# EAGLE board EEZ DIB DCP405 r2B11 (EAGLE 7.2.0), part 1 of 2
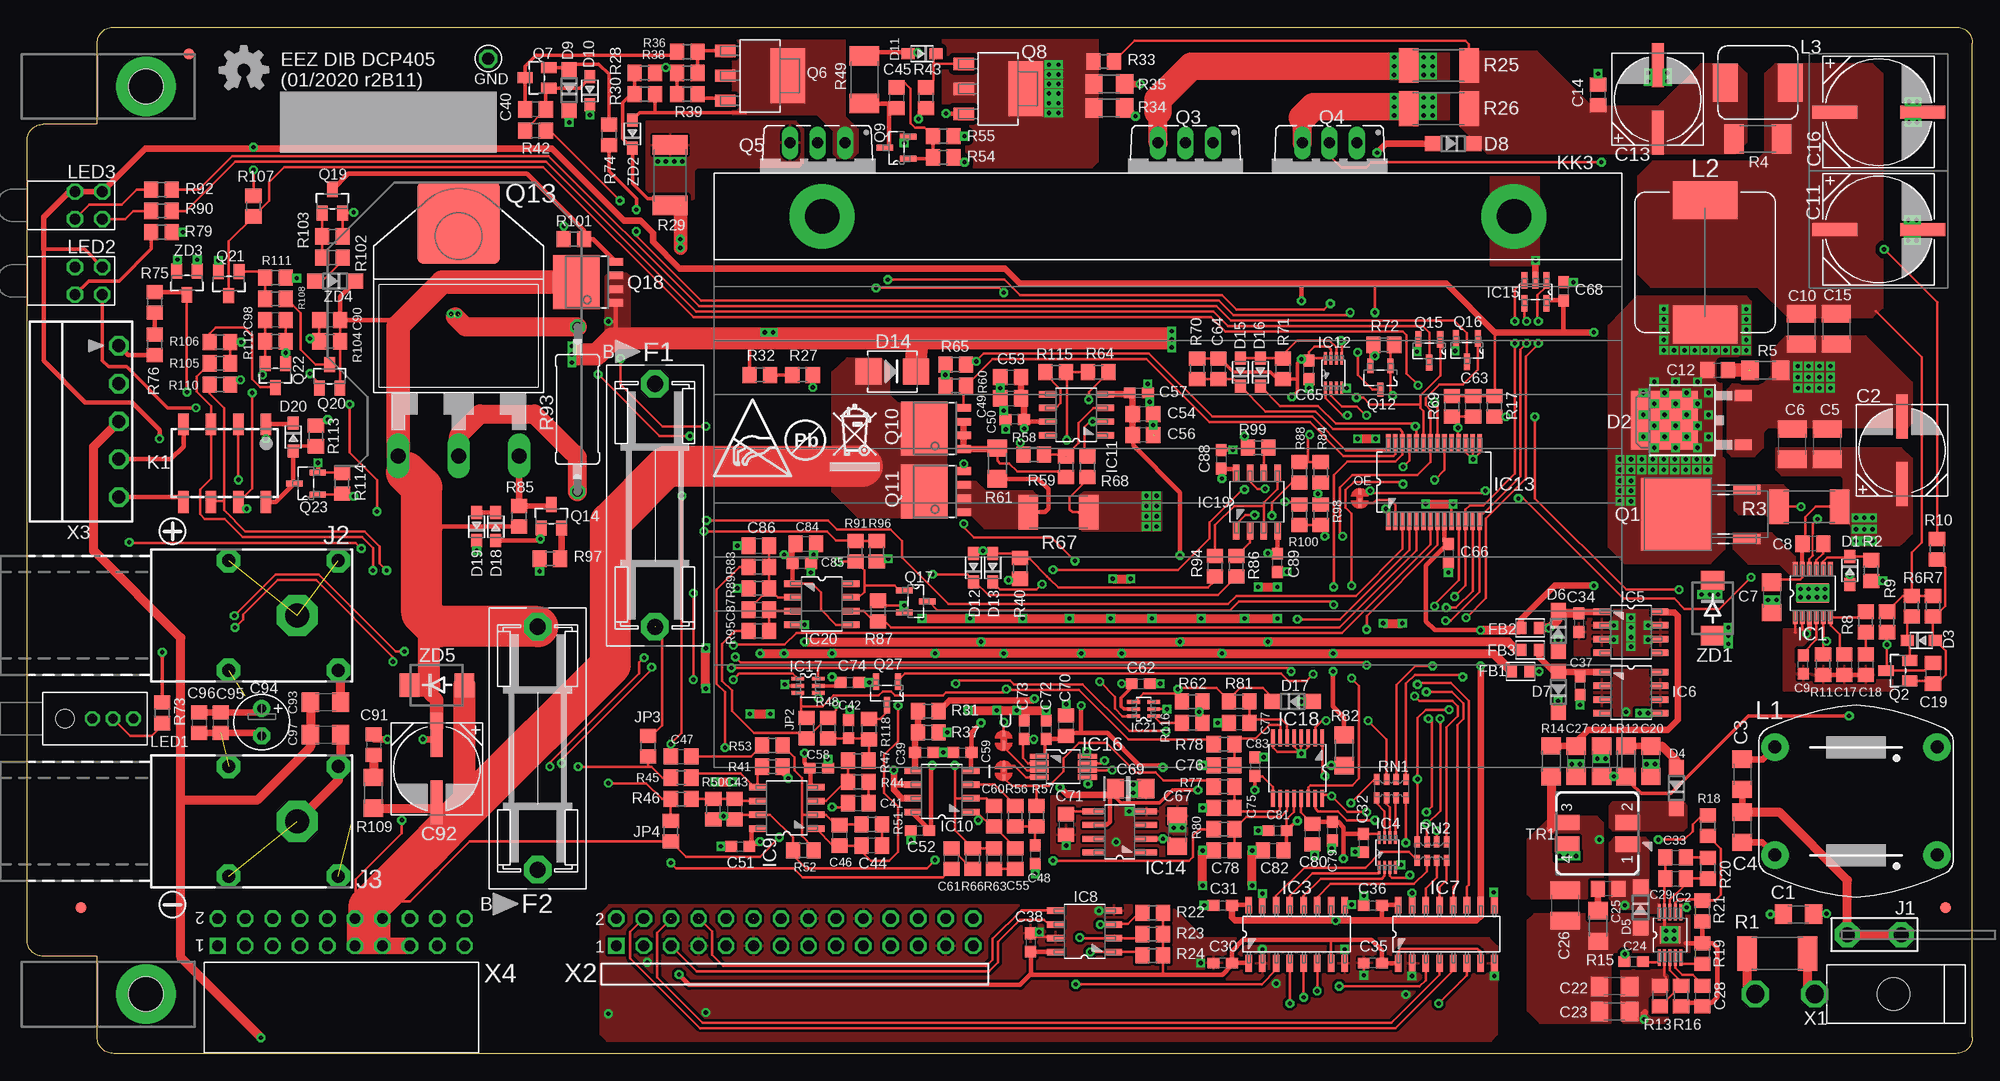
[diagram p6: board, top side]
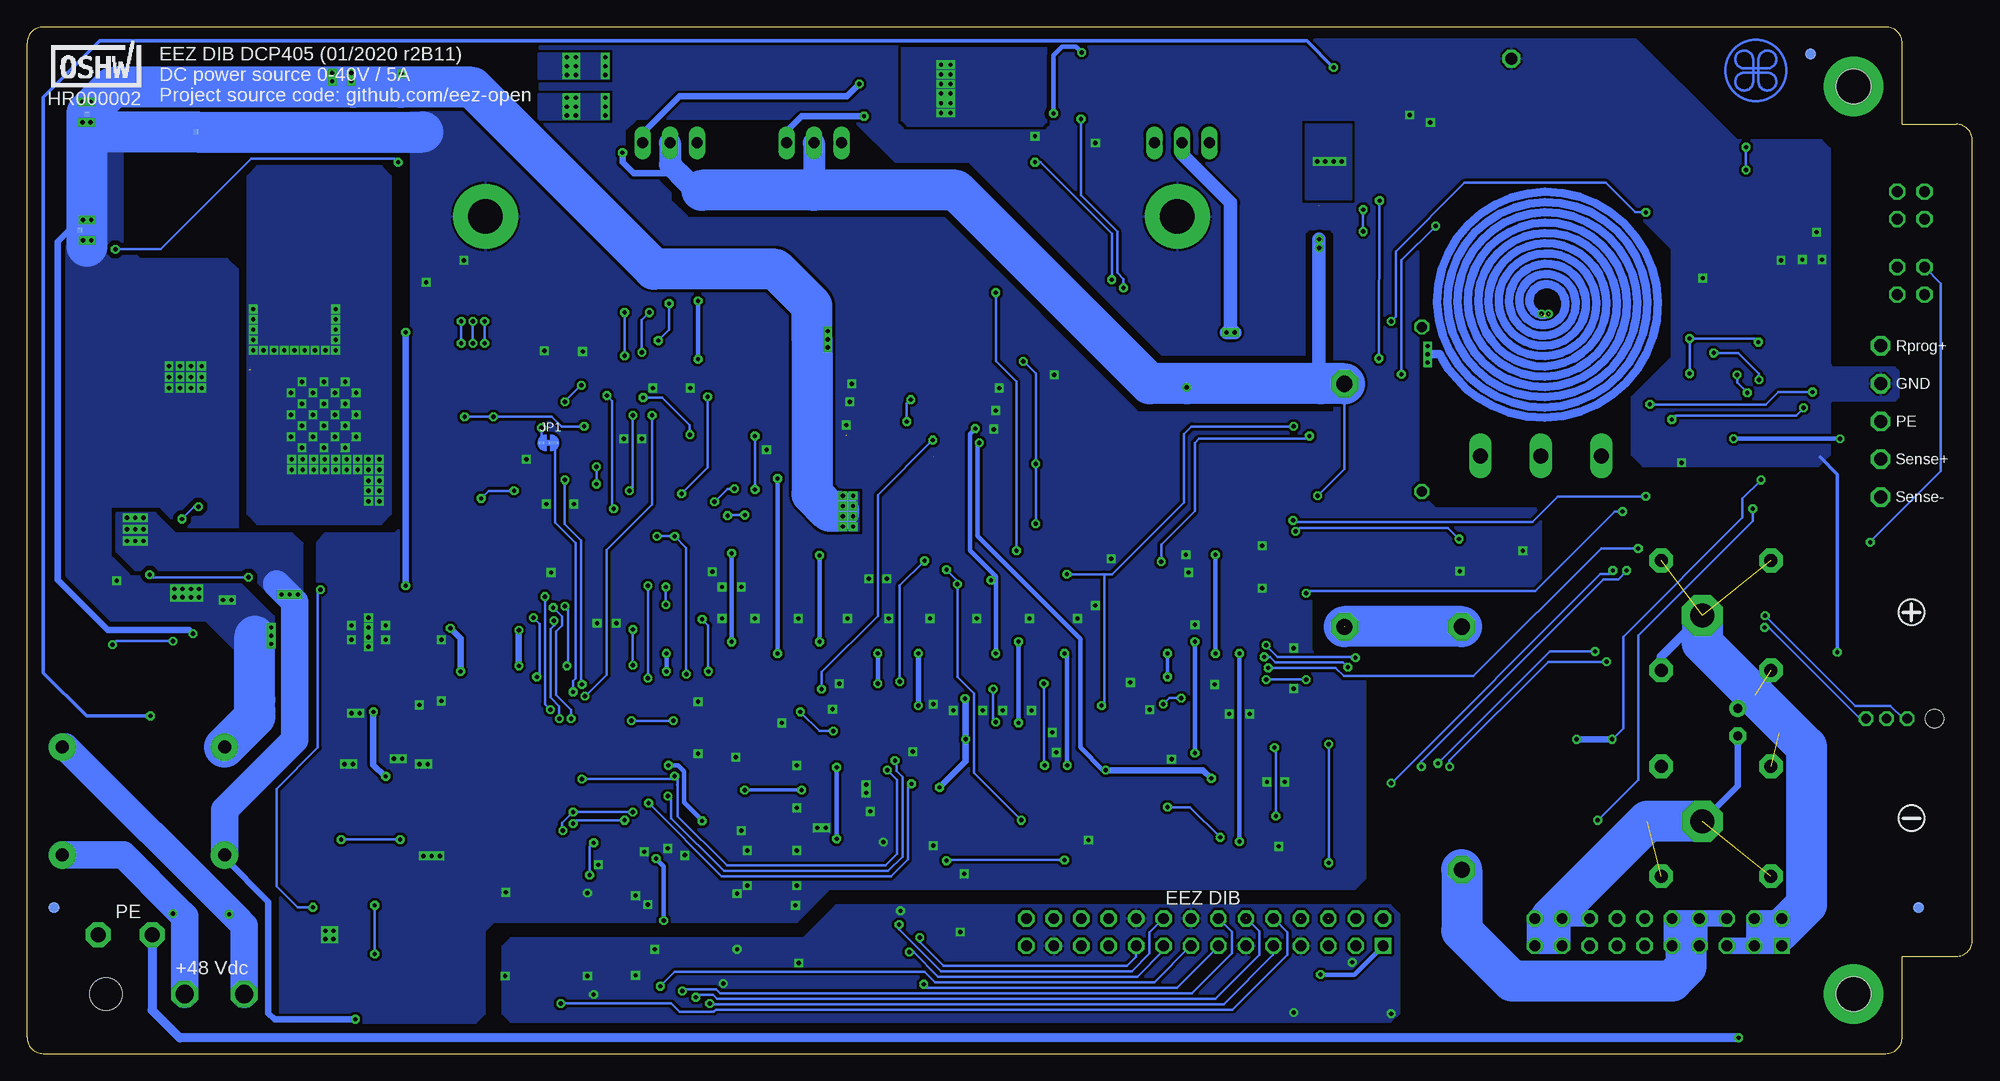
[diagram p7: board, bottom side, seen from below]

Size 180 x 95 mm. Coordinates in mm from the lower left corner, seen from the top.
Outline: 8,95 178.5,95 arc-90 180,93.5 180,1.5 arc-90 178.5,0 8,0 arc-90 6.5,1.5 6.5,9 1.5,9 arc-90 0,10.5 0,84.5 arc-90 1.5,86 6.5,86 6.5,93.5 arc-90 8,95
Copper layers (1*16): Top 0.035mm / dielectric 1.5mm / Bottom 0.035mm
Design rules "default *": minimum track width 6mil, minimum drill 0.3mm, track to track 6mil, track to pad 6mil, pad to pad 6mil, via to via 6mil, smd to smd 6mil, copper to edge 40mil, drill to drill 8mil, minimum pad ring 4mil, minimum via ring 8mil, stop-mask expansion 2.5mil, vias tented up to drill 1mm, thermal gap 8mil
Net classes: 0 default: width 0.203 mm, drill 0.3 mm, clearance 0.203 mm; 1 lvds: width 0.152 mm, drill 0.3 mm, clearance 0.152 mm to class 0, clearance 0.152 mm; 2 gnd: width 0.254 mm, drill 0.584 mm, clearance 0.254 mm
vRestrict: area 53,0 to 128,8.5; area 0,0 to 42,14

## Footprints (pad centres in the part's own frame; a part is rotated, then mirrored left to right if it is on the bottom)
C1206 = smd 1.6 x 1.8: 1 -1.4,0; 2 1.4,0
CAPAE830X1050N = smd 4.064 x 1.092: + -3.124,0; - 3.124,0
C1210 = smd 1.6 x 2.7: 1 -1.4,0; 2 1.4,0
C0805 = smd 1.3 x 1.5: 1 -0.95,0; 2 0.95,0
C0603 = smd 1.1 x 1: 1 -0.85,0; 2 0.85,0
CAPAE1030X1050N = smd 4.166 x 1.194: + -4.064,0; - 4.064,0
EC1206 = smd 1.6 x 1.8: + -1.4,0; - 1.4,0
ECAP2/5 = drill 0.813 pad 1.6: + -1.27,0 | drill 0.813 pad 1.6 octagon: - 1.27,0
SOD323-R = smd 1.2 x 1: A 1.3,0; C -1.3,0
TO252-L = smd 1 x 1.6: 1 -2.28,-6.07; 2 2.28,-6.07 | smd 5.4 x 6.2: 3 0,1.23
SOD123 = smd 1.4 x 1.4: A 1.9,0; C -1.9,0
SMB = smd 2.4 x 2.4: A 2.2,0; C -2.2,0
ZH32 = drill 1.5 pad 2.54 octagon: 1 -11.25,0; 2 11.25,0
BEAD0603 = smd 1 x 1.1: P$1 -0.85,0; P$2 0.85,0
FIDUCIAL_DUAL = smd 1.016 x 1.016 bottom: B 0,0 | smd 1.016 x 1.016: T 0,0
PCB_SHIELD_TAB = drill 1.1 octagon: 1 0,0
JP2-NOCUT = smd 0.889 x 0.254: 1 -0.445,0 | smd 0.508 x 0.254: 2 0.635,0
LTC_05-08-1666 = smd 1.27 x 0.457: 1 -2.235,1.63; 2 -2.235,0.98; 3 -2.235,0.33; 4 -2.235,-0.33; 5 -2.235,-0.98; 6 -2.235,-1.63; 7 2.235,-1.63; 8 2.235,-0.98; 9 2.235,-0.33; 10 2.235,0.33; 11 2.235,0.98; 12 2.235,1.63 | smd 1.753 x 2.946: TP 0,0
SOP50P490X110-11N = smd 1.549 x 0.279: 1 -2.108,0.991; 2 -2.108,0.508; 3 -2.108,0; 4 -2.108,-0.508; 5 -2.108,-0.991; 6 2.108,-0.991; 7 2.108,-0.508; 8 2.108,0; 9 2.108,0.508; 10 2.108,0.991 | smd 1.575 x 1.88: TP 0,0
SOIC-16 = smd 1.549 x 0.61: 1 -2.692,4.445; 2 -2.692,3.175; 3 -2.692,1.905; 4 -2.692,0.635; 5 -2.692,-0.635; 6 -2.692,-1.905; 7 -2.692,-3.175; 8 -2.692,-4.445; 9 2.692,-4.445; 10 2.692,-3.175; 11 2.692,-1.905; 12 2.692,-0.635; 13 2.692,0.635; 14 2.692,1.905; 15 2.692,3.175; 16 2.692,4.445
DCU8 = smd 1.168 x 0.254: 1 -1.372,0.75; 2 -1.372,0.25; 3 -1.372,-0.25; 4 -1.372,-0.75; 5 1.372,-0.75; 6 1.372,-0.25; 7 1.372,0.25; 8 1.372,0.75
SOIC127P600X173-8N = smd 1.55 x 0.6: 1 -2.7,1.9; 2 -2.7,0.63; 3 -2.7,-0.64; 4 -2.7,-1.91; 5 2.7,-1.91; 6 2.7,-0.64; 7 2.7,0.63; 8 2.7,1.9
SOP65P780X200-28N = smd 1.651 x 0.432: 1 -3.632,4.216; 2 -3.632,3.581; 3 -3.632,2.921; 4 -3.632,2.286; 5 -3.632,1.626; 6 -3.632,0.965; 7 -3.632,0.33; 8 -3.632,-0.33; 9 -3.632,-0.965; 10 -3.632,-1.626; 11 -3.632,-2.286; 12 -3.632,-2.921; 13 -3.632,-3.581; 14 -3.632,-4.216; 15 3.632,-4.216; 16 3.632,-3.581; 17 3.632,-2.921; 18 3.632,-2.286; 19 3.632,-1.626; 20 3.632,-0.965; 21 3.632,-0.33; 22 3.632,0.33; 23 3.632,0.965; 24 3.632,1.626; 25 3.632,2.286; 26 3.632,2.921; 27 3.632,3.581; 28 3.632,4.216
SOIC127P600X175-8N = smd 1.981 x 0.559: 1 -2.464,1.905; 2 -2.464,0.635; 3 -2.464,-0.635; 4 -2.464,-1.905; 5 2.464,-1.905; 6 2.464,-0.635; 7 2.464,0.635; 8 2.464,1.905
SOT23-5 = smd 1.524 x 0.559: 1 -1.079,1.016; 2 -1.079,0; 3 -1.079,-1.016; 4 1.079,-1.016; 5 1.079,1.016
DGK8-M = smd 1.727 x 0.483: 1 -2.235,0.965; 2 -2.235,0.33; 3 -2.235,-0.33; 4 -2.235,-0.965; 5 2.235,-0.965; 6 2.235,-0.33; 7 2.235,0.33; 8 2.235,0.965
SOT65P210X110-6N = smd 1.168 x 0.356: 1 -0.94,0.66; 2 -0.94,0; 3 -0.94,-0.66; 4 0.94,-0.66; 5 0.94,0; 6 0.94,0.66
PW(R-PDSO-G16) = smd 1.6 x 0.35: 1 -2.8,2.3; 2 -2.8,1.65; 3 -2.8,1; 4 -2.8,0.35; 5 -2.8,-0.3; 6 -2.8,-0.95; 7 -2.8,-1.6; 8 -2.8,-2.25; 9 2.8,-2.25; 10 2.8,-1.6; 11 2.8,-0.95; 12 2.8,-0.3; 13 2.8,0.35; 14 2.8,1; 15 2.8,1.65; 16 2.8,2.3
PCB_TAB-4907 = drill 1.4 pad 2.3 octagon: 1 -2.5,0; 2 2.5,0
S16N-PC = drill 2.2 pad 3.81 octagon: 1 0,0 | drill 1.2 pad 2.184 octagon: NC1 -3.8,5.08; NC2 -3.8,-5.08; NC3 6.36,5.08; NC4 6.36,-5.08
R_0805 = smd 1.3 x 1.5: 1 -0.95,0; 2 0.95,0
G6K-2F = smd 1 x 2: 1 -3.81,-3.6; 2 -1.27,-3.6; 3 1.27,-3.6; 4 3.81,-3.6; 5 3.81,3.6; 6 1.27,3.6; 7 -1.27,3.6; 8 -3.81,3.6
PCB-MB = hole 3.2: 0,0
SK96/84 = drill 3.2 pad 6: 1 10,4; 2 74,4
RN112 = drill 1.2 pad 2.54: 1 -7.5,5; 2 7.5,5; 3 -7.5,-5; 4 7.5,-5
125CDMCC/DS = smd 3.5 x 6: 1 -5.75,0; 2 5.75,0
COILCRAFT_HPI0630 = smd 2.3 x 3.5: 1 -3,0; 2 3,0
L-42WUM-1EGWT = drill 0.9 octagon: CC 4.445,0; GREEN 6.35,0; RED 2.54,0 | hole 1.7: 0,0
WP934MD = drill 1 octagon: BA -1.27,1.27; BC -1.27,-1.27; TA 1.27,1.27; TC 1.27,-1.27
TO229P990X239-3N = smd 0.94 x 2.489: 1 -2.286,-6.401; 3 2.286,-6.401 | smd 6.731 x 6.528: 2 0,0.152
SOT23-BEC = smd 1 x 1.4: B -0.95,-1.1; C 0,1.1; E 0.95,-1.1
TO220FP-V = drill 1.016 long: 1 -2.54,-0.203; 2 0,-0.203; 3 2.54,-0.203
SOT230P700X180-4N = smd 1.905 x 1.143: 1 -3.2,2.311; 2 -3.2,0; 3 -3.2,-2.311 | smd 3.175 x 5.08: 4 2.565,0
SOT103P240X110-3N = smd 1.524 x 0.559: 1 -1.079,1.016; 2 -1.079,-1.016; 3 1.079,0
SOT669 = smd 0.7 x 1.4: 1 -1.905,-2.65; 2 -0.635,-2.65; 3 0.635,-2.65; 4 1.905,-2.65 | smd 5 x 4.3: MB 0,1
SOT95P237X112-3N = smd 1.321 x 0.559: 1 -1.092,0.94; 2 -1.092,-0.94; 3 1.092,0
TOP3_TRIAC_NOHOLE = drill 1.397 long: A1 -5.588,-20.32; A2 0,-20.32; G 5.588,-20.32 | smd 7.62 x 7.62: NC 0,1.27
R2512 = smd 1.8 x 3.2: 1 -2.8,0; 2 2.8,0
R0805 = smd 1.3 x 1.5: 1 -0.95,0; 2 0.95,0
R2010 = smd 1.8 x 2.7: 1 -2.2,0; 2 2.2,0
R1206 = smd 1.6 x 1.803: 1 -1.422,0; 2 1.422,0
R_2512-4WIRE = smd 1.8 x 3.2: 1 -2.8,0; 2 2.8,0 | smd 1.27 x 0.254: 1S -2.413,0; 2S 2.413,0
0411/15 = drill 0.914 octagon: 1 -7.62,0; 2 7.62,0
CAY16 = smd 0.5 x 1: 1 -1.35,-0.85; 2 -0.45,-0.85; 3 0.45,-0.85; 4 1.35,-0.85; 5 1.35,0.85; 6 0.45,0.85; 7 -0.45,0.85; 8 -1.35,0.85
SHORT_NOHOLE = smd 0.5 x 0.25 bottom: 1 0,0.117; 2 0,-0.117
SRF0703 = smd 1.4 x 2.3: 1 1,2.8; 2 -1,2.8; 3 -1,-2.8; 4 1,-2.8
MINIFIT_39301020 = drill 1.7 octagon: 1 0,0; 2 0,5.5 | hole 3: 0,-7.3
77317-104-28LF = drill 1 pad 1.5 square: 1 -33.02,-2.54 | drill 1 pad 1.5 octagon: 2 -33.02,0; 3 -30.48,-2.54; 4 -30.48,0; 5 -27.94,-2.54; 6 -27.94,0; 7 -25.4,-2.54; 8 -25.4,0; 9 -22.86,-2.54; 10 -22.86,0; 11 -20.32,-2.54; 12 -20.32,0; 13 -17.78,-2.54; 14 -17.78,0; 15 -15.24,-2.54; 16 -15.24,0; 17 -12.7,-2.54; 18 -12.7,0; 19 -10.16,-2.54; 20 -10.16,0; 21 -7.62,-2.54; 22 -7.62,0; 23 -5.08,-2.54; 24 -5.08,0; 25 -2.54,-2.54; 26 -2.54,0; 27 0,-2.54; 28 0,0
MC1,5/5-G-3,5 = drill 1.2 octagon: 1 -7,0; 2 -3.5,0; 3 0,0; 4 3.5,0; 5 7,0
SSW-110-02-T-D-RA = drill 1 pad 1.5 square: 1 22.86,2.54 | drill 1 pad 1.5 octagon: 2 22.86,0; 3 20.32,2.54; 4 20.32,0; 5 17.78,2.54; 6 17.78,0; 7 15.24,2.54; 8 15.24,0; 9 12.7,2.54; 10 12.7,0; 11 10.16,2.54; 12 10.16,0; 13 7.62,2.54; 14 7.62,0; 15 5.08,2.54; 16 5.08,0; 17 2.54,2.54; 18 2.54,0; 19 0,2.54; 20 0,0
DO214AA = smd 1.8 x 2.2: A 2.55,0; C -2.55,0
SOT23 = smd 1 x 1.4: 1 -0.95,-1.1; 2 0.95,-1.1; 3 0,1.1

## Placement (x,y rotation side)
C1  10n/200V  [C1206]  163.89,12.89 0 top
C2  HHXC630A330MHA0G  [CAPAE830X1050N]  173.48,55.82 90 top
C3  10n/200V  [C1206]  158.69,25.84 270 top
C4  10n/200V  [C1206]  158.69,20.95 270 top
C5  4u7/100V  [C1210]  166.56,56.39 90 top
C6  4u7/100V  [C1210]  163.32,56.39 90 top
C7  1u/100V  [C1206]  161.42,42.23 270 top
C8  470n  [C0805]  165.23,47.18 180 top
C9  100n  [C0603]  164.34,36 90 top
C10  10u  [C1210]  164.15,67.06 270 top
C11  EEEFK1J101P  [CAPAE1030X1050N]  171.32,76.26 0 top
C12  470p  [C0805]  156.4,63.25 0 top
C13  EEEFK1H470P  [CAPAE830X1050N]  150.88,88.33 90 top
C14  N.C.  [C0805]  145.35,88.71 90 top
C15  10u  [C1210]  167.39,67.06 270 top
C16  EEEFK1J101P  [CAPAE1030X1050N]  171.32,87.12 0 top
C17  33p  [C0805]  168.15,36 270 top
C18  6n8  [C0805]  170.12,36 270 top
C19  470p  [C0805]  176.34,35.18 270 top
C20  4u7  [C1206]  150.24,27.05 270 top
C21  4u7  [C1206]  145.67,27.05 90 top
C22  2u2  [C1206]  146.88,6.22 180 top
C23  2u2  [C1206]  146.88,3.87 180 top
C24  100n  [C0603]  148.65,8.51 0 top
C25  330p  [C0805]  146.3,15.24 180 top
C26  22u  [C1210]  142.3,13.72 270 top
C27  4u7  [C1206]  143.32,27.05 270 top
C28  10n  [C0805]  155,5.33 270 top
C29  33p  [C0805]  152.53,16.19 0 top
C30  100n  [C0603]  110.62,8.38 180 top
C31  100n  [C0603]  110.62,13.72 0 top
C32  100n  [C0603]  123.63,19.49 270 top
C33  10n  [C0805]  152.53,18.16 0 top
C34  100n  [C0603]  143.57,39.88 270 top
C35  100n  [C0603]  124.52,8.38 180 top
C36  100n  [C0603]  124.52,13.72 0 top
C37  100n  [C0603]  143.7,34.04 90 top
C38  100n  [C0603]  92.84,10.29 270 top
C39  100n  [C0603]  82.99,27.88 0 top
C40  N.C.  [C0805]  47.05,87.38 180 top
C41  100p  [C0805]  76.9,23.18 0 top
C42  100n  [C0603]  76.01,30.04 90 top
C43  N.C.  [C0805]  65.47,22.61 270 top
C44  N.C.  [C0805]  78.17,19.24 180 top
C45  N.C.  [C0805]  80.45,88.46 270 top
C46  33p  [C0805]  75.18,20.19 270 top
C47  100p  [C0805]  60.52,27.5 0 top
C48  100n  [C0603]  93.28,18.41 270 top
C49  10n  [C0805]  91,60.64 0 top
C50  100n  [C0603]  91.38,58.67 180 top
C51  100n  [C0603]  65.98,19.18 0 top
C52  100n  [C0603]  82.61,20.64 0 top
C53  1u  [C0805]  91,62.61 0 top
C54  10n  [C0805]  103.25,59.18 180 top
C55  4n7  [C0805]  91.44,18.03 90 top
C56  1u  [C0805]  103.25,57.23 180 top
C57  100n  [C0603]  102.87,61.15 0 top
C58  100n  [C0603]  73.28,26.42 180 top
C59  100n  [C0603]  86.55,27.88 0 top
C60  33p  [C0805]  89.47,21.97 270 top
C61  6n8  [C0805]  85.53,18.03 90 top
C62  100n  [C0603]  103.06,34.23 0 top
C63  330p  [C0805]  133.79,59.88 90 top
C64  4n7  [C0805]  110.24,63.37 90 top
C65  100n  [C0603]  118.59,63.28 90 top
C66  100n  [C0603]  131.51,46.29 270 top
C67  4u7  [C1206]  106.43,20.57 90 top
C68  100n  [C0603]  142.18,70.55 90 top
C69  4u7 tant.  [EC1206]  102.11,24.51 0 top
C70  1u  [C0805]  96.14,30.35 90 top
C71  1u  [C0805]  96.14,21.21 270 top
C72  100n  [C0603]  94.3,29.97 270 top
C73  100n  [C0603]  92.27,29.97 270 top
C74  100n  [C0603]  76.14,34.35 0 top
C75  4n7  [C0805]  110.74,22.73 0 top
C76  4n7  [C0805]  110.74,26.67 0 top
C77  4n7  [C0805]  112.14,30.61 180 top
C78  4n7  [C0805]  110.74,18.8 0 top
C79  100n  [C0603]  120.78,20.57 90 top
C80  1u  [C0805]  118.94,20.32 90 top
C81  100n  [C0603]  115.7,20.64 0 top
C82  1u  [C0805]  115.32,18.8 0 top
C83  100n  [C0603]  113.6,26.54 270 top
C84  N.C.  [C0805]  72.07,47.18 0 top
C85  100n  [C0603]  71.69,45.34 180 top
C86  N.C.  [C0805]  67.69,46.99 0 top
C87  4n7  [C0805]  67.69,41.08 0 top
C88  100n  [C0603]  110.49,54.99 270 top
C89  100n  [C0603]  115.7,45.4 90 top
C90  10n  [C0805]  28,67.88 180 top
C91  470n  [C0805]  32.07,28.57 270 top
C92  HHXC630A330MHA0G  [CAPAE830X1050N]  37.91,26.35 270 top
C93  10n/200V  [C1206]  27.62,32.51 180 top
C94  N.C.  [ECAP2/5]  21.72,30.67 270 top
C95  N.C.  [C0805]  17.91,30.61 270 top
C96  N.C.  [C0805]  15.94,30.61 270 top
C97  10n/200V  [C1206]  27.62,29.53 0 top
C98  10n  [C0805]  22.99,67.88 180 top
D1  BAS316  [SOD323-R]  168.66,44.7 270 top
D2  STPS15H100  [TO252-L]  152.72,58.61 90 top
D3  BAS316  [SOD323-R]  175.26,38.23 0 top
D4  SKL16  [SOD123]  152.59,24.57 90 top
D5  SKL16  [SOD123]  149.29,13.53 270 top
D6  SKL14  [SOD123]  141.67,39.12 270 top
D7  SKL14  [SOD123]  141.67,33.46 90 top
D8  N.C.  [SOD123]  131.95,84.2 180 top
D9  SKL14  [SOD123]  50.16,89.15 90 top
D10  BAS316  [SOD323-R]  52.07,89.09 90 top
D11  BAS316  [SOD323-R]  82.8,92.52 180 top
D12  BAS316  [SOD323-R]  87.57,44.96 90 top
D13  BAS316  [SOD323-R]  89.34,44.96 90 top
D14  SK55  [SMB]  80.07,63.12 180 top
D15  BAS316  [SOD323-R]  112.27,63.06 90 top
D16  BAS316  [SOD323-R]  114.11,63.06 90 top
D17  SKL14  [SOD123]  117.09,32.58 0 top
D18  BAS316  [SOD323-R]  43.37,48.77 270 top
D19  BAS316  [SOD323-R]  41.59,48.77 90 top
D20  BAS316  [SOD323-R]  24.64,57.05 270 top
EEZ_SIGNATURE  SIGNATURESMALL  [SIGNATURE_5MM]  20.05,90.97 180 top
F1  ZH32  [ZH32]  58.1,50.74 270 top
F2  ZH32  [ZH32]  47.24,28.26 270 top
FB1  1K@100MHz  [BEAD0603]  138.18,35.37 180 top
FB2  1K@100MHz  [BEAD0603]  139.06,39.37 180 top
FB3  1K@100MHz  [BEAD0603]  139.06,37.34 180 top
FM1  FIDUCIAL_2  [FIDUCIAL_DUAL]  15,92.5 0 top
FM2  FIDUCIAL_2  [FIDUCIAL_DUAL]  177.5,13.5 0 top
FM3  FIDUCIAL_2  [FIDUCIAL_DUAL]  5,13.5 0 top
GND  [PCB_SHIELD_TAB]  42.67,92.08 0 top
I_SET  JP2-NOCUT  [JP2-NOCUT]  90.36,26.16 270 top
IC1  LTC3864EMSE#PBF  [LTC_05-08-1666]  165.23,42.61 90 top
IC2  TPS54060DGQ  [SOP50P490X110-11N]  152.02,10.99 90 top
IC3  SI8641BB-B-IS1  [SOIC-16]  117.47,11.05 90 top
IC4  SN74LVC1G139DCUR  [DCU8]  125.86,18.61 90 top
IC5  MC78L05  [SOIC127P600X173-8N]  148.4,38.99 0 top
IC6  MC79L05  [SOIC127P600X173-8N]  148.4,33.4 0 top
IC7  SI8641BB-B-IS1  [SOIC-16]  131.32,11.05 90 top
IC8  M24C32-WMN6P  [SOIC127P600X173-8N]  97.85,11.3 180 top
IC9  TL072D  [SOIC127P600X173-8N]  70.29,22.73 180 top
IC10  TL072D  [SOIC127P600X173-8N]  84.65,24.26 180 top
IC11  LTC2050HVCS8#PBF  [SOIC127P600X173-8N]  97.09,59.12 180 top
IC12  74AUP1G74DC.125  [DCU8]  120.89,62.98 90 top
IC13  MCP23S17-E/SS  [SOP65P780X200-28N]  130.18,52.9 90 top
IC14  REF5025AIDR  [SOIC127P600X175-8N]  101.09,20.51 180 top
IC15  TC77-5.0MCTTR  [SOT23-5]  139.57,70.48 270 top
IC16  DAC8552IDGKR  [DGK8-M]  95.89,26.54 0 top
IC17  SN74LVC1G3157DCKR  [SOT65P210X110-6N]  72.26,34.04 0 top
IC18  ADS1120IPWR  [PW(R-PDSO-G16)]  117.54,26.42 270 top
IC19  LM293D  [SOIC127P600X173-8N]  113.79,51.05 90 top
IC20  MAX9141ESA  [SOIC127P600X173-8N]  73.53,41.59 0 top
IC21  SN74LVC1G3157DCKR  [SOT65P210X110-6N]  103.31,31.88 180 top
J1  4907  [PCB_TAB-4907]  170.92,11 180 top
J2  FCR7350R  [S16N-PC]  25,40.55 180 top
J3  FCR7350B  [S16N-PC]  25,21.5 180 top
JP1  JP2-NOCUT  [JP2-NOCUT]  131.76,56.52 180 bottom
JP2  JP2-CUT-0805  [R_0805]  72.14,30.1 270 top
JP3  JP2-CUT-0805  [R_0805]  57.47,28.45 90 top
JP4  JP2-CUT-0805  [R_0805]  59.56,20.57 90 top
K1  G6K-2F-5DC  [G6K-2F]  18.29,54.64 180 top
KK1  PMB-1  [PCB-MB]  11,89.5 0 top
KK2  PMB-1  [PCB-MB]  11,5.5 0 top
KK3  SK96/84  [SK96/84]  147.57,81.47 180 top
L1  RN112-4-02-0M7  [RN112]  169.23,23.37 180 top
L2  125CDMCCDS-330MC  [125CDMCC/DS]  155.26,73.22 90 top
L3  VLS6045AF-3R3N  [COILCRAFT_HPI0630]  160.15,89.85 180 top
LED1  WP42WUM/EGW  [L-42WUM-1EGWT]  3.5,31 0 top
LED2  WP934MD/2LID  [WP934MD]  5.7,71.5 0 top
LED3  WP934MD/LYLID  [WP934MD]  5.7,78.5 0 top
OE  JP2-NOCUT  [JP2-NOCUT]  123.32,51.37 90 top
OSHWA  HR000002  [CERT-SMALL-SILK]  173.61,89.41 0 bottom
Q1  SUD19P06-60  [TO229P990X239-3N]  152.72,49.91 90 top
Q2  MMBT5401  [SOT23-BEC]  173.1,35.43 90 top
Q3  D45H11FP  [TO220FP-V]  107.19,84.07 180 top
Q4  D45H11FP  [TO220FP-V]  120.52,84.07 180 top
Q5  FQPF11P06 or FQPF27P06  [TO220FP-V]  73.15,84.07 180 top
Q6  BCP56-16.115  [SOT230P700X180-4N]  67.82,90.49 0 top
Q7  MMBT5401  [SOT23-BEC]  47.18,90.3 90 top
Q8  NZT605  [SOT230P700X180-4N]  89.85,89.28 0 top
Q9  BSS205NH6327XTSA1  [SOT103P240X110-3N]  80.45,83.82 180 top
Q10  PSMN0R9-25YLC  [SOT669]  84.01,57.85 90 top
Q11  PSMN0R9-25YLC  [SOT669]  84.01,52.01 90 top
Q12  BSS84P  [SOT95P237X112-3N]  125.22,62.55 270 top
Q13  BTA26-600  [TOP3_TRIAC_NOHOLE]  39.94,75.63 0 top
Q14  FMMT493TA  [SOT23-BEC]  48.51,49.72 0 top
Q15  2N7002  [SOT103P240X110-3N]  129.73,65.02 270 top
Q16  2N7002  [SOT103P240X110-3N]  133.22,65.09 270 top
Q17  2N7002  [SOT103P240X110-3N]  82.23,41.85 0 top
Q18  PSMN013-60YL  [SOT669]  51.82,71.37 90 top
Q19  MMBT5551  [SOT23-BEC]  28.26,78.87 0 top
Q20  MMBT5401  [SOT23-BEC]  28,62.67 0 top
Q21  MMBT5551  [SOT23-BEC]  18.67,71.25 180 top
Q22  MMBT5551  [SOT23-BEC]  22.99,62.74 180 top
Q23  2N7002  [SOT103P240X110-3N]  25.81,52.77 180 top
Q27  2N7002  [SOT103P240X110-3N]  79.57,33.34 270 top
R1  N.C.  [R2512]  161.93,9.27 0 top
R2  10K  [R0805]  170.62,44.7 90 top
R3  R008/2-3W  [R2512]  164.91,50.61 180 top
R4  15R  [R2010]  160.15,84.65 180 top
R5  10R  [R1206]  160.85,63.25 180 top
R6  10K  [R0805]  174.37,41.4 270 top
R7  100K  [R0805]  176.34,41.4 270 top
R8  1K  [R0805]  170.12,39.94 90 top
R9  330K  [R0805]  172.09,39.94 270 top
R10  100K  [R0805]  176.72,46.67 90 top
R11  4K7  [R0805]  166.18,36 270 top
R12  10R  [R1206]  147.96,27.05 90 top
R13  47K  [R0805]  151.07,5.33 90 top
R14  10R  [R1206]  141.03,27.05 270 top
R15  10R  [R1206]  145.35,11.81 90 top
R16  2K2  [R0805]  153.03,5.33 90 top
R17  10K  [R0805]  135.76,59.88 270 top
R18  100K  [R0805]  155.51,21.08 90 top
R19  330K  [R0805]  155,9.27 270 top
R20  86K6  [R0805]  155.51,17.14 270 top
R21  10K  [R0805]  155,13.21 90 top
R22  10K  [R0805]  104.14,13.02 180 top
R23  10K  [R0805]  104.14,11.05 180 top
R24  10K  [R0805]  104.14,9.08 180 top
R25  0R1/2-3W  [R2512]  130.62,91.44 180 top
R26  0R1/2-3W  [R2512]  130.62,87.44 180 top
R27  4K7  [R0805]  71.75,62.8 0 top
R28  N.C.  [R0805]  57.15,90.74 180 top
R29  2R2/2W  [R2512]  59.5,81.28 270 top
R30  4K7  [R0805]  57.15,88.77 0 top
R31  10K  [R0805]  83.38,31.69 180 top
R32  4K7  [R0805]  67.82,62.8 0 top
R33  2K2  [R0805]  99.63,91.82 0 top
R34  10R  [R1206]  100.14,87.5 0 top
R35  10R  [R1206]  100.14,89.73 0 top
R36  4K7  [R0805]  61.09,92.71 180 top
R37  220R  [R0805]  83.38,29.72 0 top
R38  1K  [R0805]  61.09,90.74 180 top
R39  220R  [R0805]  61.09,88.77 180 top
R40  2K2  [R0805]  91.88,44.89 270 top
R41  7K5 0.1%  [R0805]  68.96,26.54 180 top
R42  22K  [R0805]  47.05,85.41 180 top
R43  1K  [R0805]  83.19,88.46 90 top
R44  10K  [R0805]  76.9,25.15 180 top
R45  124K 0.1%  [R0805]  60.52,25.53 180 top
R46  124K 0.1%  [R0805]  60.52,23.56 180 top
R47  10K  [R0805]  76.9,27.11 180 top
R48  2K2  [R0805]  74.1,30.1 270 top
R49  15R  [R2010]  77.47,90.11 90 top
R50  7K5 0.1%  [R0805]  63.5,22.61 90 top
R51  N.C.  [R0805]  78.17,21.21 0 top
R52  10K  [R0805]  71.82,18.8 0 top
R53  10K  [R0805]  68.96,28.51 0 top
R54  220R  [R0805]  84.77,82.93 0 top
R55  100K  [R0805]  84.77,84.9 180 top
R56  2K2  [R0805]  91.44,21.97 90 top
R57  2K2  [R0805]  93.41,21.97 270 top
R58  39K 0.1%  [R0805]  93.15,55.44 0 top
R59  820R 0.1%  [R0805]  96.14,54.29 90 top
R60  47K  [R0805]  85.92,61.79 0 top
R61  1R  [R1206]  89.79,54.61 270 top
R62  47K  [R0805]  107.82,32.58 0 top
R63  8K2  [R0805]  89.47,18.03 90 top
R64  39K 0.1%  [R0805]  99.12,63.06 180 top
R65  47K  [R0805]  85.92,63.75 0 top
R66  3K3  [R0805]  87.5,18.03 90 top
R67  0R010 (low TCR)  [R_2512-4WIRE]  95.44,50.1 180 top
R68  820R 0.1%  [R0805]  98.11,54.29 90 top
R69  1K  [R0805]  131.83,59.88 270 top
R70  4K7  [R0805]  108.27,63.37 270 top
R71  10K  [R0805]  116.2,63.37 90 top
R72  100K  [R0805]  125.54,65.6 0 top
R73  270R  [R0805]  12.51,31.53 90 top
R74  2K2  [R0805]  53.85,85.03 270 top
R75  470R  [R0805]  11.81,69.53 270 top
R76  470R  [R0805]  11.81,65.6 270 top
R77  2K2  [R0805]  110.74,24.7 0 top
R78  2K2  [R0805]  110.74,28.64 0 top
R79  470R  [R0805]  12.45,76.01 180 top
R80  2K2  [R0805]  110.74,20.76 0 top
R81  2K2  [R0805]  112.14,32.58 0 top
R82  10R  [R1206]  121.86,28.07 270 top
R83  330R  [R0805]  67.69,45.02 0 top
R84  4K7  [R0805]  119.7,53.78 270 top
R85  470R  [R0805]  45.53,49.72 270 top
R86  10K  [R0805]  111.89,45.09 90 top
R87  10K  [R0805]  78.74,40.96 270 top
R88  4K7  [R0805]  117.73,53.78 90 top
R89  10K  [R0805]  67.69,43.05 180 top
R90  330R  [R0805]  12.45,77.98 0 top
R91  1K  [R0805]  76.64,46.48 270 top
R92  330R  [R0805]  12.45,79.95 180 top
R93  AC01000001007JA100  [0411/15]  50.93,59.63 270 top
R94  10K  [R0805]  109.92,45.09 270 top
R95  10K  [R0805]  67.69,39.12 0 top
R96  100K  [R0805]  78.61,46.48 90 top
R97  6R2  [R0805]  48.39,45.78 0 top
R98  4K7  [R0805]  119.7,49.85 90 top
R99  10K  [R0805]  113.92,56.07 0 top
R100  4K7  [R0805]  117.73,49.85 270 top
R101  1K  [R0805]  50.61,75.37 180 top
R102  22K  [R0805]  28.26,73.66 0 top
R103  22K  [R0805]  28.26,75.63 180 top
R104  330R  [R0805]  28,65.91 0 top
R105  750R  [R0805]  17.84,63.88 0 top
R106  3K3  [R0805]  17.84,65.85 0 top
R107  10K  [R0805]  20.95,78.42 90 top
R108  10K  [R0805]  22.99,69.85 0 top
R109  1R  [R1206]  32.07,24.13 90 top
R110  750R  [R0805]  17.84,61.91 180 top
R111  47K  [R0805]  22.99,71.82 180 top
R112  330R  [R0805]  22.99,65.91 0 top
R113  470R  [R0805]  26.73,57.15 90 top
R114  100K  [R0805]  29.15,52.77 270 top
R115  220R  [R0805]  95.19,63.06 180 top
R116  470R  [R0805]  107.82,30.61 0 top
R118  22K  [R0805]  77.91,30.04 270 top
RN1  DR1206-33R-4/8  [CAY16]  126.24,24.51 0 top
RN2  DR1206-33R-4/8  [CAY16]  129.98,18.73 0 top
SH1  [SHORT_NOHOLE]  164.4,85.28 270 top
SH2  Pgnd to Pout- short  [SHORT_NOHOLE]  174.43,86.93 0 top
SH3  Sgnd to Pgnd short  [SHORT_NOHOLE]  175.13,76.2 270 top
TR1  SRF0703-821M  [SRF0703]  145.29,20.38 270 top
U$1  [RECYCLE_BIN1/8]  74.3,53.91 0 top
U$6  [ESD_SYMBOL]  63.59,53.43 0 top
U$7  [PB_SMALL]  72.01,56.77 0 top
U_SET  JP2-NOCUT  [JP2-NOCUT]  90.36,28.96 90 top
X1  39-30-1020  [MINIFIT_39301020]  165.41,5.5 90 top
X2  77317-104-20LF  [77317-104-28LF]  87.54,12.5 0 top
X3  691322110005  [MC1,5/5-G-3,5]  8.5,58.5 270 top
X4  DS1024-2*10R0  [SSW-110-02-T-D-RA]  40.5,12.5 180 top
ZD1  SMAJ51A  [DO214AA]  155.96,41.21 270 top
ZD2  MM3Z9V1T1G  [SOD323-R]  56.01,85.09 90 top
ZD3  SLVU2.8-TP  [SOT23]  14.8,71.31 180 top
ZD4  MMSZ5230BT1G  [SOD123]  28.51,71.5 180 top
ZD5  SMAJ51A  [DO214AA]  37.91,34.1 0 top

## Tracks (layer width: path | path; a pad name or v marks a point on that pad's centre or on a via)
5A_S
  pour Top (isolate 0.254, no thermals): 85.98,52.9 87.82,52.9 88.71,52.01 93.03,52.01 93.41,51.63 93.41,48.64 88.58,48.64 87.38,49.85 85.98,49.85
50MA_S
  Top 0.254: R61.1 89.79,54.86 90.04,54.61 90.87,54.61 91.63,53.85 95.89,53.85 96.14,53.59 R59.1
  Top 0.61: Q10.3 Q10.2 Q10.1 89.24,55.94 R61.1
!ADC_DRDY  (via drill 0.4)
  Top 0.254: IC18.14 118.54,24.62 118.75,24.83 122.62,24.83 123.25,25.46 123.25,34.04 v122.56,34.73 | v127.32,52.7 127.13,52.9 122.75,52.9 121.98,52.13 121.98,50.55 122.56,49.97 v122.56,43.31 | IC13.25 127.89,54.86 v127.32,54.29
  Bottom 0.254: v127.32,54.29 v127.32,52.7 | v122.56,43.31 v122.56,34.73
!DP_DRIVE
  Top 0.305: 50.42,91.31 D9.A | Q7.E 49.97,91.25 D9.A | D9.A 50.16,91.31 50.42,91.57 52.9,91.57 53.85,90.61 R74.1
!IOEXP_RST  (via drill 0.4)
  Top 0.254: IC13.18 132.4,56.59 v132.4,57.91 132.4,58.36 R69.2 C63.1
  Bottom 0.254: JP1.2 v132.4,57.91
!OVP_FAULT  (via drill 0.4)
  Top 0.254: Q17.3 83.44,41.85 84.26,41.02 111.32,41.02 112.14,41.85 120.59,41.85 v120.9,41.53 | v120.9,43.18 120.9,53.53 122.17,54.8 126.62,54.8 127.25,55.44 IC13.26 127.25,57.53 127,57.78 120.84,57.78 119.19,59.44 114.59,59.44 D15.C 111.6,62.42 C64.1 R70.2
  Bottom 0.254: v120.9,41.53 v120.9,43.18
!RESET  (via drill 0.4)
  Top 0.254: IC7.12 131.95,15.43 132.33,15.81 132.33,30.42 132.91,30.99 132.91,32.38 131.83,33.47 v129.48,33.47
  Bottom 0.254: v129.48,33.47 129.48,34.48 129.22,34.73 129.22,47.24 131.13,49.15 131.13,56.33 JP1.1
!SET_DP  (via drill 0.4)
  Top 0.254: IC13.1 125.96,50.19 v125.73,50.42 | R72.2 126.16,65.52 Q12.1 126.16,61.1 v126.36,60.9
  Bottom 0.254: v125.73,50.42 125.86,50.55 125.86,60.39 v126.36,60.9
+3V3  (via drill 0.4)
  Top 0.254: IC7.7 134.49,9.4 134.18,9.72 127.13,9.72 126.87,9.46 IC7.1 | R22.1 R23.1 R24.1 105.09,7.3 | IC3.7 120.65,10.41 120.78,10.54
  Top 0.406: IC7.1 125.33,8.36 C35.1 125.37,9.56 124.4,10.54 120.78,10.54 112.52,10.54 111.47,9.49 C30.1 | 92.88,9.68 C38.2 92.87,9.4 | C30.1 111.51,8.22 111.51,8.19 110.62,7.3 105.09,7.3 92.9,7.3 92.87,7.33 | IC3.1 113,8.38 C30.1 | 92.87,9.4 92.87,7.33 | IC8.8 92.87,9.4 | 92.87,7.33 91.89,6.35 61.28,6.35 v60.33,7.3
  Bottom 0.406: v60.33,7.3 57.18,7.3 X2.1
+5V  (via drill 0.4)
  Top 0.254: IC3.10 120.65,12.38 v121.09,12.32 | IC18.13 117.89,22.32 C80.2 | 138.3,66.67 138.24,66.74 | Q12.2 124.28,65.54 R72.1 124.59,64.7 v124.71,64.58 | R84.2 119.44,52.58 v119.44,51.82 119.44,50.54 R98.2 | 123.74,20.32 125.11,20.32 IC4.8 | v124.71,68.58 124.71,71.25 | R69.1 C63.2 R17.1 135.83,60.89 135.83,66.74 | R70.1 C64.2 | R107.2 v20.96,81.79 | 118.62,64.16 118.62,64.9 119.13,65.41 120.4,65.41 120.64,65.16 IC12.7 | 118.81,64.35 IC12.8
  Top 0.305: IC15.5 140.59,69.72 | 118.81,64.35 C65.2 118.3,64.13 | 1.52,74.42 5.32,74.42 LED2.TA | 117.54,62.42 117.54,63.88 v117.92,64.26 | 117.54,62.42 117.54,61.28 v117.03,60.77 | 117.54,62.42 R71.1 115.69,62.42 115.06,63.06 111.63,63.06 110.62,64.07 110.55,64.07 110.3,64.32 C64.2
  Top 0.406: D20.C 24.52,58.24 K1.1 v22.1,56.9 | v12.26,56.9 12.26,57.72 9.72,60.26 5.4,60.26 1.52,64.14 1.52,74.42 | IC7.16 125.4,13.74 C36.2 125.37,12.41 125.28,12.32 | IC3.16 111.49,13.74 C31.2 | C80.2 119.09,21.42 C79.2 121.32,21.42 121.79,20.95 121.79,20.32 | v121.79,18.03 121.79,20.32 | C32.1 123.74,20.32 121.79,20.32 | C66.1 131.47,47.01 131.28,47.01 129.41,45.15 129.41,40.01 130.24,39.18 v134.49,39.18 | IC13.9 131.14,47.38 C66.1 | 142.15,69.72 142.15,66.89 142.3,66.74 | 140.59,69.72 142.15,69.72 | 142.15,69.72 C68.1 | v117.92,69.66 117.92,71.25 | v117.92,64.26 118.62,64.16 C65.2 | C66.1 131.41,47.14
  Top 0.508: 1.52,74.42 1.52,77.41 3.89,79.77 LED3.BA LED3.TA
  Top 0.61: C31.2 111.47,12.61 111.76,12.32 v121.09,12.32 125.28,12.32 134.11,12.32 134.49,12.7 IC7.10 v134.49,35.88 | FB2.P$2 138.22,40.17 141.35,43.31 v144.97,43.31 | LED3.TA 10.96,83.76 20.83,83.76 v20.95,83.88 v20.96,83.88 21.08,83.76 48.58,83.76 55.24,77.09 56.77,77.09 57.91,75.95 57.91,75.12 60.39,72.64 90.49,72.64 91.89,71.25 117.92,71.25 124.71,71.25 131.32,71.25 135.83,66.74 138.24,66.74 142.3,66.74 v144.97,66.74
  Top 0.813: v134.49,39.18 138.02,39.18 FB2.P$2
  Bottom 0.254: v124.71,64.58 v124.71,68.58 | v117.03,60.77 117.03,54.23 v119.44,51.82 | v20.96,81.79 v20.96,83.88
  Bottom 0.406: v22.1,56.9 v12.26,56.9 | v121.09,12.32 121.09,17.34 v121.79,18.03 | v117.92,64.26 v117.92,69.66
  Bottom 0.61: v144.97,66.74 v144.97,43.31 | v134.49,35.88 v134.49,39.18
+5VOUT  (via drill 0.4)
  Top 0.61: IC5.1 143.73,40.89 C34.1 | FB1.P$1 v139.89,35.37
  Top 0.813: FB2.P$1 139.89,39.4 v140.84,39.37 141.67,40.2 D6.C 141.77,40.73 C34.1
  Bottom 0.61: v139.89,35.37 139.89,38.42 v140.84,39.37
+VNR
  Top 0.61: IC5.8 151.16,40.83 152.4,40.83 152.72,40.51 152.72,30.86 151.83,29.97 144.46,29.97 143.32,28.83 C27.1 | C27.1 143.7,28.45 143.89,28.64 | R14.1 143.3,28.47 C27.1
+VREF  (via drill 0.4)
  Top 0.254: IC18.9 115.25,23.65 115.25,24.7 114.33,25.63 113.67,25.63 C83.2 113.51,26.1 | 92.2,29.06 C73.2 92.14,29 92.14,27.37 92.63,26.87 IC16.2 | 100.14,24.7 100.14,24.26 100.2,24.19
  Top 0.305: 100.14,24.7 100.39,24.45 100.39,24.19 100.39,24 | 100.39,24 101.22,23.18 104.78,23.18 105.98,24.38 v108.33,24.38 | v113.6,24.38 C83.2 | 100.39,24 100.33,24 100.14,23.81 | v93.15,29.08 92.37,29.08 C73.2
  Top 0.406: 100.39,24.19 C69.+ 100.2,24.45 100.2,24.19 100.2,21.46 99.89,21.14 IC14.6
  Top 0.61: v95.57,24.64 96.27,23.94 100.14,23.94 C69.+ | v93.22,32.83 93.09,32.7 85.34,32.7 R31.1
  Bottom 0.254: 93.15,32.77 v93.22,32.83
  Bottom 0.305: v108.33,24.38 v113.6,24.38
  Bottom 0.61: 93.15,32.77 v93.15,29.08 93.15,27.05 v95.57,24.64
-9V  (via drill 0.4)
  Top 0.305: v168.59,31.24 159.26,31.24 152.08,24.07 149.35,24.07 148.4,25.02 148.4,25.18 R12.1 147.93,25.65 | 59.7,88.33 R39.2 R38.2 59.63,91.25 v59.12,91.25 58.73,91.25 R28.1
  Top 0.61: 147.93,25.65 v146.81,25.65 C21.1
  Bottom 0.305: v168.59,31.24 174.5,31.24 178.5,35.24 178.5,88.52 173.29,93.73 61.59,93.73 v59.12,91.25
  Bottom 0.61: v146.81,25.65 146.88,25.65 147.96,26.73 v147.96,31.62
  pour Top (isolate 0.254): 145.03,31.31 145.03,35.5 151.76,35.5 151.76,31.31
AUX_IN  (via drill 0.4)
  Top 0.254: IC17.1 70.84,35.18 65.91,35.18 v65.34,34.61 65.85,35.12 | v14.8,61.21 ZD3.3 | v29.84,60.07 29.84,55.63 32.38,53.09 v32.38,50.16 | v61.66,34.61 v61.66,42.61
  Top 0.406: R75.1 14.86,70.48 14.86,70.27 ZD3.3
  Bottom 0.254: v14.8,61.21 17.97,61.21 19.11,60.07 v29.84,60.07 | v65.34,34.61 v61.66,34.61 | v61.66,42.61 61.47,42.8 40.45,42.8 33.08,50.16 v32.38,50.16
AUX_USET_SW  (via drill 0.4)
  Top 0.254: IC17.6 73.2,35.67 73.15,35.69 | 73.15,35.69 v65.15,35.69 | IC13.4 127.89,46.61 121.47,40.2 v117.54,40.2 | 73.15,35.69 116.65,35.69 v116.97,35.37 | v30.92,46.74 30.42,47.24 9.53,47.24 v9.46,47.31
  Bottom 0.254: v116.97,35.37 116.97,39.62 v117.54,40.2 | LED2.BA 2.92,71.26 2.92,53.91 9.46,47.37 v9.46,47.31 | v30.92,46.74 34.35,46.74 46.16,34.92 58.17,34.92 58.93,35.69 v65.15,35.69
CC_ACTIVE  (via drill 0.4)
  Top 0.254: R100.2 R98.1 | 129.86,56.52 IC13.22 | IC13.22 129.84,54.72 128.65,53.53 122.62,53.53 121.47,52.39 121.47,48.13 v121.73,47.88 | Q16.1 134.24,63.31 132.84,61.91 130.68,61.91 129.41,60.64 129.41,60.01 129.86,59.56 129.86,56.54 IC13.22 | 119.83,48.77 R98.1 | v120.08,47.88 120.08,48.52 R98.1 | Q27.1 80.58,34.54 81.22,35.18 116.01,35.18 116.71,34.48 118.36,34.48 v119,35.12
  Bottom 0.254: v121.73,47.88 v120.08,47.88 119,46.8 v119,35.12
CC_LED
  Top 0.254: R92.2 10.16,79.95 8.76,78.55 5.75,78.55 LED3.BC
CS_ADC  (via drill 0.4)
  Top 0.254: IC18.2 119.19,30.16 119.83,30.8 v120.21,30.8 | RN1.7 125.79,29.09 v124.08,30.8
  Bottom 0.254: v124.08,30.8 v120.21,30.8
CS_DAC  (via drill 0.4)
  Top 0.254: v122.49,23.18 124.67,25.36 RN1.8 | v98.17,24.96 98.17,25.4 IC16.5
  Bottom 0.254: v98.17,24.96 98.49,24.64 98.49,17.97 100.08,16.38 115.76,16.38 v122.49,23.18
CS_IOEXP  (via drill 0.4)
  Top 0.254: RN1.6 126.69,34.1 128.46,35.88 v130.05,35.88 | IC13.11 132.46,43.81 130.24,41.59 v130.24,41.4
  Bottom 0.254: v130.05,35.88 129.92,36.01 129.92,41.08 v130.24,41.4
CSA
  Top 0.254: IC4.1 125.09,17.22 125.09,16.7 118.94,16.7 116.84,14.61 IC3.13
CSB
  Top 0.254: IC3.12 118.11,14.61 119.7,16.19 125.35,16.19 125.61,16.45 IC4.2
CURR_5A  (via drill 0.4)
  Top 0.254: R65.2 87.18,64.07 v87.82,64.07 88.52,64.77 103.82,64.77 109.67,58.93 118.94,58.93 122.05,55.82 125.86,55.82 125.98,55.94 125.98,56.5 IC13.28 | v86.68,49.02 86.68,48.7 87.63,47.75 94.81,47.75 v96.97,45.59 | v86.66,54.59 Q11.4 | IC21.6 101.37,31.22 100.65,31.94 100.65,33.02 v99.25,34.42
  Bottom 0.254: v87.82,64.07 86.66,62.91 v86.66,54.59 86.66,49.04 v86.68,49.02 | v96.97,45.59 99.25,43.31 v99.25,34.42
CURR_50MA
  Top 0.254: 87.06,59.75 Q10.4 86.66,61.58 R60.2 | R60.2 | R60.2 89.34,64.26 103.57,64.26 109.41,58.42 118.68,58.42 121.79,55.31 126.43,55.31 126.59,55.47 IC13.27
CV_ACTIVE  (via drill 0.4)
  Top 0.254: R88.2 118.36,54.73 | 118.36,54.73 R84.1 | Q15.1 130.75,62.74 128.91,60.9 128.91,60.13 | IC13.23 129.21,59.45 128.91,59.75 128.91,60.13 | 128.91,60.13 128.84,60.07 124.27,60.07 123.64,60.71 v123,60.71 | v118.68,57.28 118.49,57.09 118.49,54.86 118.36,54.73
  Bottom 0.254: v123,60.71 121.22,60.71 118.68,58.17 v118.68,57.28
CV_LED
  Top 0.254: R90.1 9.84,77.98 9.1,77.23 LED3.TC
D_CC
  Top 0.254: R92.1 15.88,79.95 18.99,83.06 48.26,83.06 62.17,69.15 110.05,69.15 111.38,67.82 132.08,67.82 133.22,66.67 Q16.3
D_CV
  Top 0.254: R90.2 14.67,77.98 19.24,82.55 48.01,82.55 61.91,68.64 109.79,68.64 111.12,67.31 129.16,67.31 129.73,66.74 Q15.3
DARL_C  (via drill 0.4)
  other vias: 94.55,91.5 94.55,90.61 94.55,89.73 94.55,88.84 94.55,87.95 94.55,87.06 95.44,91.5 95.44,90.61 95.44,89.73 95.44,88.84 95.44,87.95 95.44,87.06
  pour Top (isolate 0.406, no thermals): 84.77,95 99.06,95 99.06,82.55 98.55,82.04 85.09,82.04 84.77,82.36
  pour Bottom (isolate 0.406, no thermals): 85.72,93.47 99.06,93.47 99.06,86.36 98.55,85.85 86.04,85.85 85.72,86.17
DC+  (via drill 0.4)
  Top 0.406: C1.2 166.43,12.89 v166.5,12.95
  Top 0.813: R1.2 164.72,6.19 X1.1
  Bottom 0.406: v166.5,12.95 166.08,13.37
  Bottom 2.54: X1.1 165.41,12.69 166.08,13.37 171.09,18.37 L1.1
DC-  (via drill 0.4)
  Top 0.406: C1.1 v161.29,12.89
  Top 0.813: R1.1 159.12,6.29 X1.2
  Bottom 0.406: v161.29,12.89 160.97,12.89 160.62,12.54
  Bottom 2.54: X1.2 159.91,11.83 160.62,12.54 176.45,28.37 L1.3
DC_OUT  (via drill 0.4)
  Top 0.254: C8.2 164.25,47.15 164.25,47.22 164.53,47.5 164.53,49.66 165.48,50.61 R3.1 | IC1.11 164.25,44.04 164.08,43.85 161.48,43.85 C7.1 | IC2.2 151.51,7.18 151.64,7.05
  Top 0.305: C8.2 164.21,47.18
  Top 0.356: IC1.11 164.25,47.15
  Top 0.406: ZD1.C v155.7,42.48
  Top 0.61: v149.61,3.17 149.61,3.75 149.67,3.81 | C4.2 160.54,19.55 L1.2
  Bottom 0.61: L1.2 161.73,18.09 157.67,14.03 157.67,3.75 157.1,3.17 v149.61,3.17
  Bottom 2.54: 156.91,43.43 155.26,41.78 155.26,29.02 161.73,22.55 L1.2
  other vias: 170.75,47.43 169.23,47.43 169.99,48.51 169.23,48.51 169.23,49.59 169.99,49.59 170.75,49.59 169.99,47.43 170.75,48.51 156.46,42.48 154.94,42.48
  pour Top (isolate 0.305, no thermals): 161.86,56.01 173.42,56.01 174.37,55.05 174.37,48.13 173.74,47.5 173.23,47.05 168.85,47.05 168.85,48.77 168.4,49.15 168.08,49.15 168.08,53.21 167.77,53.53 162.37,53.53 161.86,54.04
  pour Bottom (isolate 0.406, no thermals): 155.45,48.13 166.24,48.13 168.15,50.04 171.7,50.04 171.7,46.48 169.99,44.77 159.83,44.77 156.97,41.91 154.56,41.91 154.56,47.24
  pour Top (isolate 0.305, no thermals): 151.07,9.46 151.83,9.46 151.83,3.17 151.51,2.86 147.76,2.86 147.51,3.11 147.51,7.68 151.07,7.68
DIB_A0  (via drill 0.4)
  Top 0.254: R24.2 102.87,9.4 IC8.1 v98.37,9.4 v98.36,9.4
  Bottom 0.254: X2.17 74.84,9.55 77.28,7.11 95.69,7.11 97.98,9.4 v98.36,9.4
DIB_A1  (via drill 0.4)
  Top 0.254: R23.2 103.19,10.67 IC8.2 97.47,10.67 v97.41,10.73
  Bottom 0.254: X2.19 77.41,9.93 77.41,8.95 78.23,8.13 95.19,8.13 97.41,10.35 v97.41,10.73
DIB_A2  (via drill 0.4)
  Top 0.254: R22.2 102.87,13.02 101.85,12 100.61,12 IC8.3 v99.32,11.94 v99.31,11.94
  Bottom 0.254: X2.18 76.14,11.2 76.14,9.27 77.79,7.62 95.44,7.62 99.31,11.49 v99.31,11.94
DIB_CSA  (via drill 0.4)
  Top 0.254: v116.84,4.64 IC3.4
  Bottom 0.254: X2.9 64.71,9.93 64.71,9.14 69.28,4.57 116.78,4.57 v116.84,4.64
DIB_CSB  (via drill 0.4)  (1 unrouted)
  Top 0.254: IC3.5 v118.11,5.21
  Bottom 0.254: 67.17,12.5 65.98,11.3 65.98,9.14 70.04,5.08 116.14,5.08 116.52,5.46 117.86,5.46 v118.11,5.21
DIB_IRQ  (via drill 0.4)
  Top 0.254: IC7.6 133.22,7.24 v130.62,4.64
  Bottom 0.254: X2.10 64.63,12.5 63.37,11.24 63.37,9.14 68.45,4.06 116.27,4.06 116.46,3.87 119.63,3.87 120.4,4.64 v130.62,4.64
DIB_MISO  (via drill 0.4)
  Top 0.254: IC3.6 v119.38,5.78
  Bottom 0.254: X2.14 68.52,11.26 68.52,9.27 72.2,5.59 115.89,5.59 116.27,5.97 119.19,5.97 v119.38,5.78
DIB_MOSI  (via drill 0.4)
  Top 0.254: IC7.3 129.41,6.79 128.84,6.22 v121.41,6.22
  Bottom 0.254: X2.15 72.34,9.96 75.69,6.6 96.01,6.6 96.97,7.56 120.08,7.56 v121.41,6.22
DIB_NRESET
  Top 0.254: IC7.5 131.95,7.68 126.62,2.35 62.29,2.35 55.82,8.83 55.82,11.26 X2.4
DIB_SCL
  Top 0.203: IC8.6 95.76,11.94
  Top 0.254: IC8.6 94.55,11.94 94.11,12.38 91.89,12.38 89.85,10.35 89.85,8.45 89.03,7.62 61.94,7.62 X2.5
DIB_SCLK  (via drill 0.4)
  Top 0.254: IC3.3 115.57,7.75 114.24,6.41 v97.03,6.41
  Bottom 0.254: X2.13 69.76,9.93 73.6,6.1 96.71,6.1 v97.03,6.41
DIB_SDA  (1 unrouted)
  Top 0.254: IC8.5 95.09,13.27 92.01,13.27 89.34,10.6 89.34,8.7 88.77,8.13 64.39,8.13 63.37,9.14 63.37,11.3 62.18,12.5
DP_S  (via drill 0.4)
  Top 0.305: 59.05,83.63 R29.1
  other vias: 59.12,82.55 59.88,82.55 60.64,82.55 58.36,82.55
  pour Top (isolate 0.305): 57.34,86.23 71.12,86.23 71.82,85.53 71.82,82.42 71.44,82.04 62.04,82.04 61.66,81.66 61.66,79.12 61.59,79.06 57.66,79.06 57.34,79.12
  pour Bottom (isolate 0.305): 57.53,85.98 61.66,85.98 61.66,79.06 57.53,79.06
FB  (via drill 0.4)
  Top 0.254: 165.93,36.89 R11.1 166.21,37.43 166.21,38.1 | 166.21,38.1 IC1.5 | v166.5,38.16 166.27,38.16 166.21,38.1 | v172.09,37.85 R9.2 172.09,35.52 Q2.C 175.64,35.43 C19.1
  Bottom 0.254: v166.5,38.16 171.77,38.16 v172.09,37.85
GCOM  (via drill 0.4)
  Top 0.406: R41.1 69.91,25.97 v70.42,25.46 | R58.1 92.08,55.31 v91.89,56.52 | IC10.7 | 80.26,24.9 80.2,24.96
  Top 0.61: v80.2,26.23 80.2,24.96 80.2,24.38 80.96,23.62 IC10.7 | IC10.6 80.26,24.9
  Bottom 0.406: v80.2,26.23 80.45,26.23 82.55,28.32 82.55,38.35 92.08,47.88 92.08,56.33 v91.89,56.52
  Bottom 0.61: v80.2,26.23 71.18,26.23 v70.42,25.46
GND  (via drill 0.4)  (1 unrouted)
  Top 0.254: C58.1 v74.11,27.24 | C83.1 v114.43,27.43 | C81.1 v113.92,20.64 | v113.35,18.8 C82.1 | C76.1 v108.78,26.67 | C75.1 v108.78,22.73 | C78.1 v108.78,18.8 | C77.2 v110.17,30.61 | IC18.8 115.29,28.35 115.7,27.94 117.73,27.94 v117.92,27.75 | Q23.2 29.08,53.78 | v24.96,71.75 R111.1 | IC12.4 122.1,61.61 v122.11,61.59 | 118.64,62.42 C65.1 118.59,61.62 v118.62,61.59 | C51.1 v64.2,19.18 | v114.3,14.8 IC3.15 | IC7.9 135.79,13.72 135.79,14.83 v135.7,14.92 | v122.56,13.78 121.96,13.78 IC3.9 | C80.1 v119.13,18.35 | C79.1 v120.71,18.99 | v98.04,27.94 98.04,27.56 IC16.8 | IC4.4 127.03,17.23 v127.13,17.46 | C49.1 v90.04,61.59 v90.05,61.6 C53.1 | v90.36,59.5 C50.2 | IC20.4 v71.94,39.68 v71.94,39.69 | C86.1 v65.72,46.99 | R89.2 v65.72,43.05 | Q15.2 v128.59,64.96 | v132.14,65.02 132.14,66.1 Q16.2 | IC13.10 131.8,50.71 v131.95,50.86 | C37.1 v143.7,32.26 | 152.91,4.51 R16.1 | 151.51,11.49 v151.64,11.37 | IC2.9 151.51,16.03 C29.1 C33.1 | v142.56,18.29 142.94,19.03 TR1.4 | v146.05,27.3 146.05,28.07 C21.2 | C27.2 143.32,26.42 v142.94,26.8 | R65.1 v84.96,62.8 R60.1 | IC6.5 v149.99,31.49 v149.99,31.5 | IC18.4 117.89,27.78 v117.92,27.75 | IC18.5 117.24,28.43 v117.92,27.75 | IC18.3 118.54,28.37 v117.92,27.75 | D10.C v52.07,86.87 | Q17.2 v81.15,41.47 78.8,41.47 78.74,41.53 R87.1 | v50.16,86.17 D9.C | IC13.16 133.76,55.03 v133.79,54.99 | IC13.17 133.1,55.69 v133.79,54.99 | IC13.15 134.39,55.59 v133.79,54.99 | C48.2 v93.28,16.64 | v17.72,73.41 Q21.E | C42.2 76.14,30.89 v76.14,31.81 | D17.A v117.92,32.58 | C74.2 v77.92,34.35 77.98,34.42 Q27.2 | IC21.2 v105.47,31.88 | C62.2 v104.84,34.23
  Top 0.279: IC2.9 151.51,11.49
  Top 0.305: ZD3.1 v15.74,73.47 v15.75,73.47 | ZD3.2 13.85,73.41 v13.91,73.47 | v14.41,76.01 13.46,76.01 R79.1 | C52.1 v81.79,19.75 | C59.1 v84.77,27.88 C39.2 | v79.69,45.78 R96.1 | v47.43,44.64 R97.1 | 104.27,57.28 104.2,57.21 | v12.51,37.15 R73.2 | C73.1 92.27,31.62 92.14,31.75 | C68.2 143.04,71.4 v143.06,71.37 | IC17.2 70.23,34.04 v70.1,34.16 | R55.1 v86.74,84.9 | R37.2 v85.15,29.72
  Top 0.406: 29.08,53.78 R114.1 | v26.92,54.67 26.92,53.82 Q23.2 | v128.14,14.86 IC7.15 | v123.7,14.61 123.7,13.8 C36.1 | C70.2 v96.14,32.32 | C72.1 v94.3,31.75 | IC14.4 v101.98,22.42 | C69.- 102.49,24.51 v102.36,24.13 | C67.2 106.43,21.21 v106.11,20.89 | C71.2 v96.14,19.24 | C31.1 v108.9,13.72 | D19.C v41.59,46.55 | C56.1 104.25,57.28 v104.2,58.17 C54.1 | v103.69,61.98 C57.2 | C84.2 v72.77,46.16 | C85.1 v72.52,44.51 | C66.2 v131.51,44.51 | v122.87,18.67 123.74,18.67 C32.2 | R19.1 155.96,10.22 156.4,9.78 156.4,5.21 155.89,4.7 155.32,4.7 C28.2 154.88,4.7 153.03,4.7 R16.1 | R21.1 R19.1 | R19.1 153.48,10.22 | v149.86,26.8 149.86,26.03 C20.2 | v141.67,32.64 D7.C | C89.1 v116.59,44.58 | v111.57,55.88 110.53,55.88 C88.1 | v81.15,84.26 81.41,84.71 Q9.2
  Top 0.61: D6.A v141.67,38.29 | IC15.2 v139.57,73.41
  Top 0.813: v94.3,31.75 92.14,31.75 v91.57,31.75 v89.72,31.75 87.12,31.75 | v66.86,31.43 v68.77,31.43 | v63.63,25.15 v65.28,25.15 | v113.35,15.56 v113.35,18.8 | v108.78,15.56 v108.78,18.8 | v100.46,43.94 v102.11,43.94 | v125.48,39.81 v127.25,39.81 | v123.13,56.9 v124.78,56.9 | v62.8,33.78 v62.8,37.53 | v82.8,40.26 v87.25,40.26 v92.14,40.26 v96.46,40.26 v100.27,40.26 v104.08,40.26 v108.65,40.26 v112.65,40.26 v115.7,40.26 | v129.41,50.86 v131.95,50.86 | v113.92,43.18 v115.7,43.18
  Bottom 0.254: v84.96,62.8 84.96,62.74
  Bottom 0.305: 14.1,55.18 12.51,53.59 v12.51,37.15
  Bottom 3.81: SH1.2 143.38,85.28
  other vias: 106.87,20.89 102.36,24.89 100.77,19.56 146.81,39.62 103.89,60.33 90.55,57.78 149.22,31.5 148.4,39.43 152.4,11.37 152.4,10.6 151.64,10.6 143.7,26.8 141.8,18.29 145.29,27.3 150.62,26.8 87.06,31.75 143.32,18.29 148.4,37.66 146.81,38.29 148.4,40.32 149.99,39.62 149.99,38.29 148.4,38.54
  pour Top (isolate 0.203): 94.81,23.81 107.31,23.81 107.31,18.29 94.81,18.29
  pour Bottom (isolate 0.254, rank 2): 13.97,84.52 21.78,84.52 32.26,95 132.52,95 132.52,87.12 144.46,87.12 144.46,49.66 145.99,48.13 152.4,48.13 153.16,47.24 153.16,27.62 156.59,24.19 156.59,3.68 155.77,2.86 138.49,2.86 137.67,3.68 137.67,11.3 136.78,12.19 108.78,12.19 105.73,15.24 57.15,15.24 56.2,16.19 56.2,35.62 57.09,36.51 60.33,36.51 61.21,37.4 61.21,41.91 60.33,42.8 40.45,42.8 39.94,43.31 39.94,49.91 40.45,50.42 49.66,50.42 51.31,52.07 51.31,76.26 46.99,80.58 33.97,80.58 27.81,74.42 27.81,64.45 31.5,60.77 31.5,55.37 30.48,54.36 14.29,54.36 13.21,55.44 13.21,60.2 12.95,60.45 7.18,60.45 6.86,60.77 6.86,63.18 7.18,63.5 12.95,63.5 13.21,63.75 13.21,83.76
  pour Top (isolate 0.254): 143.19,36.89 143.19,41.08 151.76,41.02 151.76,36.83
  pour Top (isolate 0.254, rank 2, no thermals): 139.45,12.89 153.8,12.89 153.8,9.4 146.88,9.4 146.49,9.02 146.49,2.86 139.95,2.86 138.87,3.94 138.87,12.32
  pour Top (isolate 0.254, no thermals): 135.45,81.09 139.89,81.09 139.89,72.96 135.45,72.96
GNDIO  (via drill 0.4)
  Top 0.254: IC7.2 v128.14,7.18 | v123.7,7.24 C35.2 | 92.75,11.37 C38.1 93.18,10.79 93.66,10.79 | IC8.7 95.15,10.7 95.25,10.79 93.66,10.79 | v93.66,11.24 93.66,10.79
  Top 0.406: IC7.8 v135.76,7.18 | IC3.2 v114.3,9.65
  other vias: 108.58,8.38 121.92,9.65 99.19,13.21 53.78,3.68 57.4,8.45 127.57,5.46 62.8,3.81 115.57,6.48
  pour Bottom (isolate 0.254): 53.85,13.72 53.09,12.95 53.09,3.68 53.85,2.92 135.25,2.92 136.02,3.68 136.02,9.91 135.25,10.67 108.2,10.67 105.16,13.72
  pour Top (isolate 0.254): 53.85,13.72 53.09,12.95 53.09,1.78 53.66,1.21 135.45,1.21 136.02,1.78 136.02,9.91 135.25,10.67 108.84,10.67 105.79,13.72
HOLE_DL  (via drill 3.2 pad 5.5)
  other vias: 11,5.5
HOLE_UL  (via drill 3.2 pad 5.5)
  other vias: 11,89.5
I_MON  (via drill 0.4)
  Top 0.254: 96.08,62.99 R115.1 | R64.2 R115.1 | v96.2,56.77 96.2,62.99 R115.1 | D17.C 115.19,33.02 114.36,33.85 112.2,33.85 111.19,32.83 R81.1 111.19,32.7 110.05,33.85 106.62,33.85 v106.49,33.72 106.49,33.21 | IC21.4 102.51,32.54 103.31,33.34 106.36,33.34 106.49,33.21 | 106.49,33.21 106.49,32.96 R62.1
  Bottom 0.254: v96.2,56.77 101.28,51.69 101.28,40.51 106.49,35.31 v106.49,33.72
I_SERVO  (via drill 0.4)
  Top 0.254: D13.C 89.34,43.62 90.04,42.93 93.41,42.93 v93.92,43.43 | C55.2 91.38,19.05 91.38,19.11 C60.2 89.22,21.02 88.01,22.23 | 87.47,22.36 87.47,22.33 87.57,22.23 88.01,22.23 | 88.01,22.23 v88.01,21.59 | v112.65,57.15 112.65,55.75 R99.1 | v112.65,52.2 112.46,52.2 109.41,49.15 109.41,47.69 106.49,44.77 v94.93,44.77
  Top 0.305: IC10.1 87.47,22.36
  Bottom 0.254: v112.65,52.2 v112.65,57.15 | v88.01,21.59 92.39,25.97 92.39,33.34 93.92,34.86 v93.92,43.43 93.92,43.75 v94.93,44.77
I_SET
  Top 0.254: R77.1 109.22,25.27 105.16,25.27 104.39,26.04 102.62,26.04 99.89,28.77 97.35,28.77 95.89,27.3 95.89,26.1 94.55,24.77 93.47,24.77 | 90.74,25.84 I_SET.2 91.12,24.77 93.47,24.77 | R57.1 93.41,24.7 93.47,24.77
IRQ  (via drill 0.4)
  Top 0.254: IC13.20 131.14,53.99 v130.24,53.09 | v128.65,34.16 128.78,34.29 131.76,34.29 133.41,32.64 133.41,15.62 133.22,15.43 IC7.11
  Bottom 0.254: v128.65,34.16 128.71,34.23 128.71,47.5 130.24,49.02 v130.24,53.09
ISENSE+  (1 unrouted)
  Top 0.254: IC11.3 98.68,59.76 97.28,58.36 97.28,56.52 96.71,55.94 96.71,55.44 96.58,55.31 96.2,55.31 R59.2 | R58.2 95.95,55.44 R59.2
ISENSE-  (via drill 0.4)
  Top 0.254: 97.98,55.24 R68.2 97.86,55.24 97.85,55.24 97.85,57.98 98.36,58.48 v98.61,58.48 v98.62,58.49 IC11.2 | R64.1 99.95,62.93 98.23,61.21 v98.23,60.52
  Bottom 0.254: v98.61,58.48 98.61,60.13 v98.23,60.52
L_OUT
  Top 0.254: R7.1 R6.1 | R6.1 174.37,46.35 175.32,47.31 175.32,64.45 171.07,68.71 | R6.1 173.55,42.35 R9.1
  pour Top (isolate 0.406, no thermals): 149.1,72.14 149.1,81.22 150.43,82.55 159.96,82.55 160.85,83.44 160.85,90.68 161.73,91.57 170.75,91.57 171.64,90.68 171.64,69.02 170.75,68.14 162.94,68.14 160.08,70.99 150.24,70.99
LOOP_CTRL  (via drill 0.4)
  Top 0.254: 88.39,46.26 D13.A 91.47,46.26 R40.1 92.39,45.84 92.39,45.78 92.78,45.78 94.39,44.16 94.61,43.94 95.44,43.12 109.28,43.12 109.85,43.69 109.85,44.07 R94.2 | 88.39,46.26 D12.A | v88.46,46.55 88.46,46.32 88.39,46.26 | v78.55,70.87 89.92,70.87 v90.36,70.42 | v82.49,86.49 82.49,87.19 R43.1
  Bottom 0.254: v88.46,46.55 88.46,62.17 90.36,64.07 v90.36,70.42 | v82.49,86.49 82.49,79.44 79.12,76.07 79.12,72.26 78.55,71.69 v78.55,70.87
MISO  (via drill 0.4)
  Top 0.254: IC18.15 119.19,22.67 119.44,22.42 121.28,22.42 122.11,21.59 v124.71,21.59 | v129.47,21.27 v129.48,21.27 | v129.48,21.27 129.54,21.27 130.75,22.48 v130.75,30.99 | 129.52,21.23 v129.48,21.27 | IC15.4 138.56,67.94 v138.75,67.75 | RN2.7 129.53,21.21 v129.48,21.27 | v138.75,65.72 138.18,65.15 138.18,53.4 134.39,49.62 IC13.14 | IC13.14 134.39,42.7 131.76,40.07 v131.25,40.07 | 134.43,49.3 IC13.14
  Bottom 0.254: v124.71,21.59 129.16,21.59 v129.48,21.27 | v138.75,67.75 v138.75,65.72 | v131.25,40.07 131.25,39.62 131.57,39.31 131.57,32.96 130.75,32.13 v130.75,30.99
MOSI  (via drill 0.4)
  Top 0.254: IC16.7 99.45,26.87 v99.69,27.11 | IC18.16 119.84,23.94 120.59,23.94 v120.71,23.81 122.17,22.35 v123.95,22.35 | v131.32,41.27 132.21,41.27 133.76,42.82 IC13.13 | v130.42,20.63 v130.43,20.64 v130.44,20.63 RN2.6 | v129.48,22.35 129.98,22.86 129.98,30.67 v129.67,30.99
  Bottom 0.254: v120.71,23.81 120.4,23.5 120.4,21.78 115.51,16.89 100.33,16.89 99,18.22 99,25.59 99.57,26.16 99.57,26.99 v99.69,27.11 | v123.95,22.35 v129.48,22.35 130.49,21.34 130.49,20.7 v130.43,20.64 | v131.32,41.27 130.49,40.45 130.49,39.62 131.06,39.05 131.06,33.21 129.67,31.81 v129.67,30.99
N$1
  Top 0.254: Q2.E 174.2,37.99 D3.C 173.96,40.17 R6.2
N$2
  Top 0.254: R8.1 C18.1
N$3
  Top 0.254: RN2.4 131.33,16.02 130.68,15.37 IC7.13
N$4
  Top 0.254: IC4.5 126.61,23.58 RN1.3
N$6
  Top 0.254: IC4.7 125.61,22.41 124.89,23.13 RN1.1 124.89,23.32
N$7
  Top 0.254: IC1.8 166.21,45.56 166.56,45.91 168.56,45.91 D1.C 170.27,46 R2.2
N$8
  Top 0.254: C17.1 167.71,36.96 167.71,38.8 166.88,39.62 166.88,40.35 IC1.6 169.6,40.37 R8.2
N$9
  Top 0.254: IC3.11 119.38,14.48 120.59,15.68 128.33,15.68 129.53,16.89 RN2.2
N$10
  Top 0.254: R56.1 R57.2 93.28,20.89 C48.1
N$11
  Top 0.254: R67.2S 93.73,50.1
  Top 0.406: R61.2 93.56,53.19 94.49,52.26 94.49,50.42 94.17,50.1 93.73,50.1
N$12
  Top 0.254: R73.1 12.51,30.35 11.56,29.4 9.54,29.4 LED1.CC
N$13  (via drill 0.4)
  Top 0.254: IC20.7 76.96,42.22 77.47,42.74 77.47,43.37 | 77.47,43.37 77.47,44.71 R91.2 v75.06,45.53 | v49.66,76.58 R101.2 | v61.34,57.15 58.55,57.15 v52.83,62.87 | Q17.1 80.71,42.86 80.26,43.31 77.53,43.31 77.47,43.37
  Bottom 0.254: v75.06,45.53 75.06,47.12 71.94,50.23 71.94,56.52 71.56,56.9 61.59,56.9 v61.34,57.15 | v52.83,62.87 52.83,73.41 v49.66,76.58
N$14
  Top 0.254: R51.2 C44.1
N$15
  Top 1.778: Q13.A2 39.94,57.21 41.91,59.18 46.93,59.18 49.94,56.17 50.1,56.01 50.93,55.18 R93.2
N$16
  Top 0.254: IC16.4 92.41,25.58 91.38,26.61 I_SET.1 90.42,26.8
N$17
  Top 0.406: R75.2 R76.1
N$18
  Top 0.508: R85.1 48.36,50.67 Q14.C
  Top 0.61: Q13.G R85.1
N$19
  Top 0.61: Q14.E 49.46,45.91 R97.2
N$20
  Top 0.406: D19.A D18.C
N$21  (via drill 0.4)
  Top 0.254: 76.13,47.43 R91.1 | R91.1 R96.2 | v62.61,48.32 74.04,48.32 74.87,47.5 76.58,47.5 R91.1
  Top 0.406: D18.A 43.53,47.5 47.38,47.5 v47.5,47.62 47.5,48.56 Q14.B
  Bottom 0.254: v62.61,48.32 62.29,48.64 48.52,48.64 v47.5,47.62
N$22
  Top 0.254: IC4.6 126.11,22.8 125.79,23.11 RN1.2
N$23
  Top 0.254: IC1.9 165.56,45.67 166.18,46.29 C8.1
N$24
  Top 0.254: R102.2 29.21,73.4 27.3,71.5 ZD4.A
N$25
  cutout Bottom: 59.25,59.56 59.25,75.82 59.5,76.07 61.34,76.07 61.59,75.82 61.59,64.45 75.06,64.45 92.9,82.3 99.69,82.3 103.7,86.3 123.57,86.3 124.46,85.41 124.46,82.49 123.95,81.98 122.49,81.98 120.21,79.69 120.21,78.99 118.75,77.53 95.12,77.53 77.15,59.56
N$26
  Top 0.61: C25.2 145.35,13.04 R15.2
N$27
  Top 0.254: IC1.4 165.56,38.3 164.34,37.08 C9.2
N$28
  Top 0.254: Q19.B R103.2 R102.1
N$29
  Top 0.61: FB3.P$1 139.91,36.68 141.23,35.36 D7.A 141.73,35.3 143.7,35.3 | IC6.1 143.7,35.3 | C37.2 143.7,35.3
N$30
  pour Top (isolate 0.305, no thermals): 163.58,44.32 163.13,44.32 162.12,45.34 159.26,45.34 157.92,46.67 157.92,48.13 161.42,48.13 163.58,45.97
N$31
  Top 0.254: IC20.3 68.64,40.95 C87.2 R95.2
N$32
  Top 0.406: X3.1 9.35,64.64 R76.2
N$33
  Top 0.203: R89.1 68.64,42.99 C87.1
  Top 0.254: IC20.2 69.47,42.22 R89.1 R83.2 C86.2
N$34
  Top 0.254: IC2.3 152.02,7.68 152.91,6.79 R16.2 151.26,4.51 151.01,4.51 R13.1
N$35
  Top 0.406: Q9.3 79.76,83.82 79.76,87.91 | R49.1 79.76,87.91 | 79.76,87.91 80.43,87.91 C45.2
N$36
  Top 0.254: IC16.3 92.53,26.21 90.36,28.38 U_SET.1
N$37
  Top 0.254: C55.1 R63.1
N$38  (1 unrouted)
  Top 1.27: C12.2 159.32,63.25
N$39
  Top 0.305: Q6.1 62.13,92.8 R36.1 R38.1
N$40  (via drill 0.4)
  Top 0.61: R35.2 v103,89.72
  Bottom 0.61: Q4.1 123.06,85.15 119.63,88.58 104.14,88.58 v103,89.72
N$41
  Top 0.254: IC2.4 152.53,7.94 153.16,7.3 154.11,7.3 155,6.41 C28.1
N$42  (via drill 0.4)
  Top 0.254: v123.13,64.9 123.13,62.8 124.47,61.45 Q12.3 | v122.43,68.58 122.17,68.33 111.63,68.33 110.3,69.66 62.36,69.66 56.39,75.63 v56.39,76.07
  Top 0.305: R74.2 53.85,81.66 56.39,79.12 v56.39,78.11
  Bottom 0.254: v56.39,76.07 v56.39,78.11 | v123.13,64.9 123.13,67.88 v122.43,68.58
N$43  (via drill 0.4)
  Top 0.61: R34.2 101.79,87.5 v102.55,86.74
  Bottom 0.61: v102.55,86.74 108.33,86.74 109.73,85.34 Q3.1
N$44
  Top 0.406: Q19.C 29.7,81.41 46.29,81.41 51.56,76.14 R101.1 52.37,75.37 Q18.4
N$45
  Top 0.305: C40.2 46.1,90.27 Q7.C | Q7.C 45.75,90.3 | R36.2 59.82,92.39 47.12,92.39 46.08,91.36 Q7.C
N$46
  Top 0.254: 83.82,92.23 D11.C 83.86,92.27 83.86,91.59 | Q8.1 83.86,91.59 | 83.86,91.59 83.86,90.08 R43.2
N$47  (via drill 0.4)
  Top 0.406: Q8.3 85.03,86.97 v85.03,87 | D11.A 81.38,92.65 v82.42,92.65 77.81,92.65 R49.2
  Bottom 0.406: v85.03,87 85.03,92.39 84.26,93.15 82.93,93.15 v82.42,92.65
N$48
  Top 0.254: R19.2 153.04,8.32 153.03,8.32 153.03,8.85 IC2.5
N$49